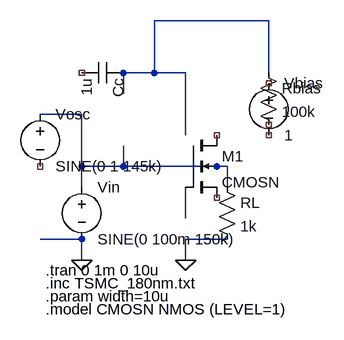
[diagram p0: schematic nmos_mixer.asc]
nmos_mixer.asc, the LTspice schematic file:
Version 4
SHEET 1 880 680
WIRE -32 -64 -80 -64
WIRE -80 -64 -80 -32
WIRE -80 48 -80 80
WIRE 16 0 16 32
WIRE 16 112 16 160
WIRE -80 80 16 80
WIRE -80 80 -144 80
WIRE -144 80 -144 112
WIRE -208 0 -144 0
WIRE -144 0 -144 80
WIRE 16 80 80 80
WIRE 80 80 80 112
WIRE -208 192 -144 192
WIRE 80 192 16 192
WIRE -32 -144 -32 -64
WIRE 144 -144 -32 -144
WIRE 144 -64 144 -144
WIRE -32 -64 16 -64
WIRE 16 -64 16 0
WIRE 16 192 16 224
WIRE -144 192 -144 224
FLAG 16 224 0
FLAG -144 224 0
SYMBOL nmos4 16 32 R0
SYMATTR InstName M1
SYMATTR Value CMOSN
SYMBOL voltage -144 96 R0
SYMATTR InstName Vin
SYMATTR Value SINE(0 100m 150k)
SYMBOL voltage -208 -16 R0
SYMATTR InstName Vosc
SYMATTR Value SINE(0 1 145k)
SYMBOL cap -80 -80 R90
SYMATTR InstName Cc
SYMATTR Value 1u
SYMBOL res 128 -80 R0
SYMATTR InstName Rbias
SYMATTR Value 100k
SYMBOL voltage 144 -64 R0
SYMATTR InstName Vbias
SYMATTR Value 1
SYMBOL res 64 96 R0
SYMATTR InstName RL
SYMATTR Value 1k
TEXT -200 240 Left 2 !.tran 0 1m 0 10u
TEXT -200 260 Left 2 !.inc TSMC_180nm.txt
TEXT -200 280 Left 2 !.param width=10u
TEXT -200 300 Left 2 !.model CMOSN NMOS (LEVEL=1)

The netlist it stands for:
* nmos_mixer.asc
* M1: CMOSN (symbol nmos4 not certain, pin order unknown); nets seen at it: N002, N003
Vin N002 0 SINE(0 100m 150k)
Vosc N002 NC_03 SINE(0 1 145k)
Cc N001 NC_04 1u
Rbias N001 NC_05 100k
Vbias NC_06 NC_07 1
RL N002 0 1k
.tran 0 1m 0 10u
.inc TSMC_180nm.txt
.param width=10u
.model CMOSN NMOS (LEVEL=1)
.backanno
.end